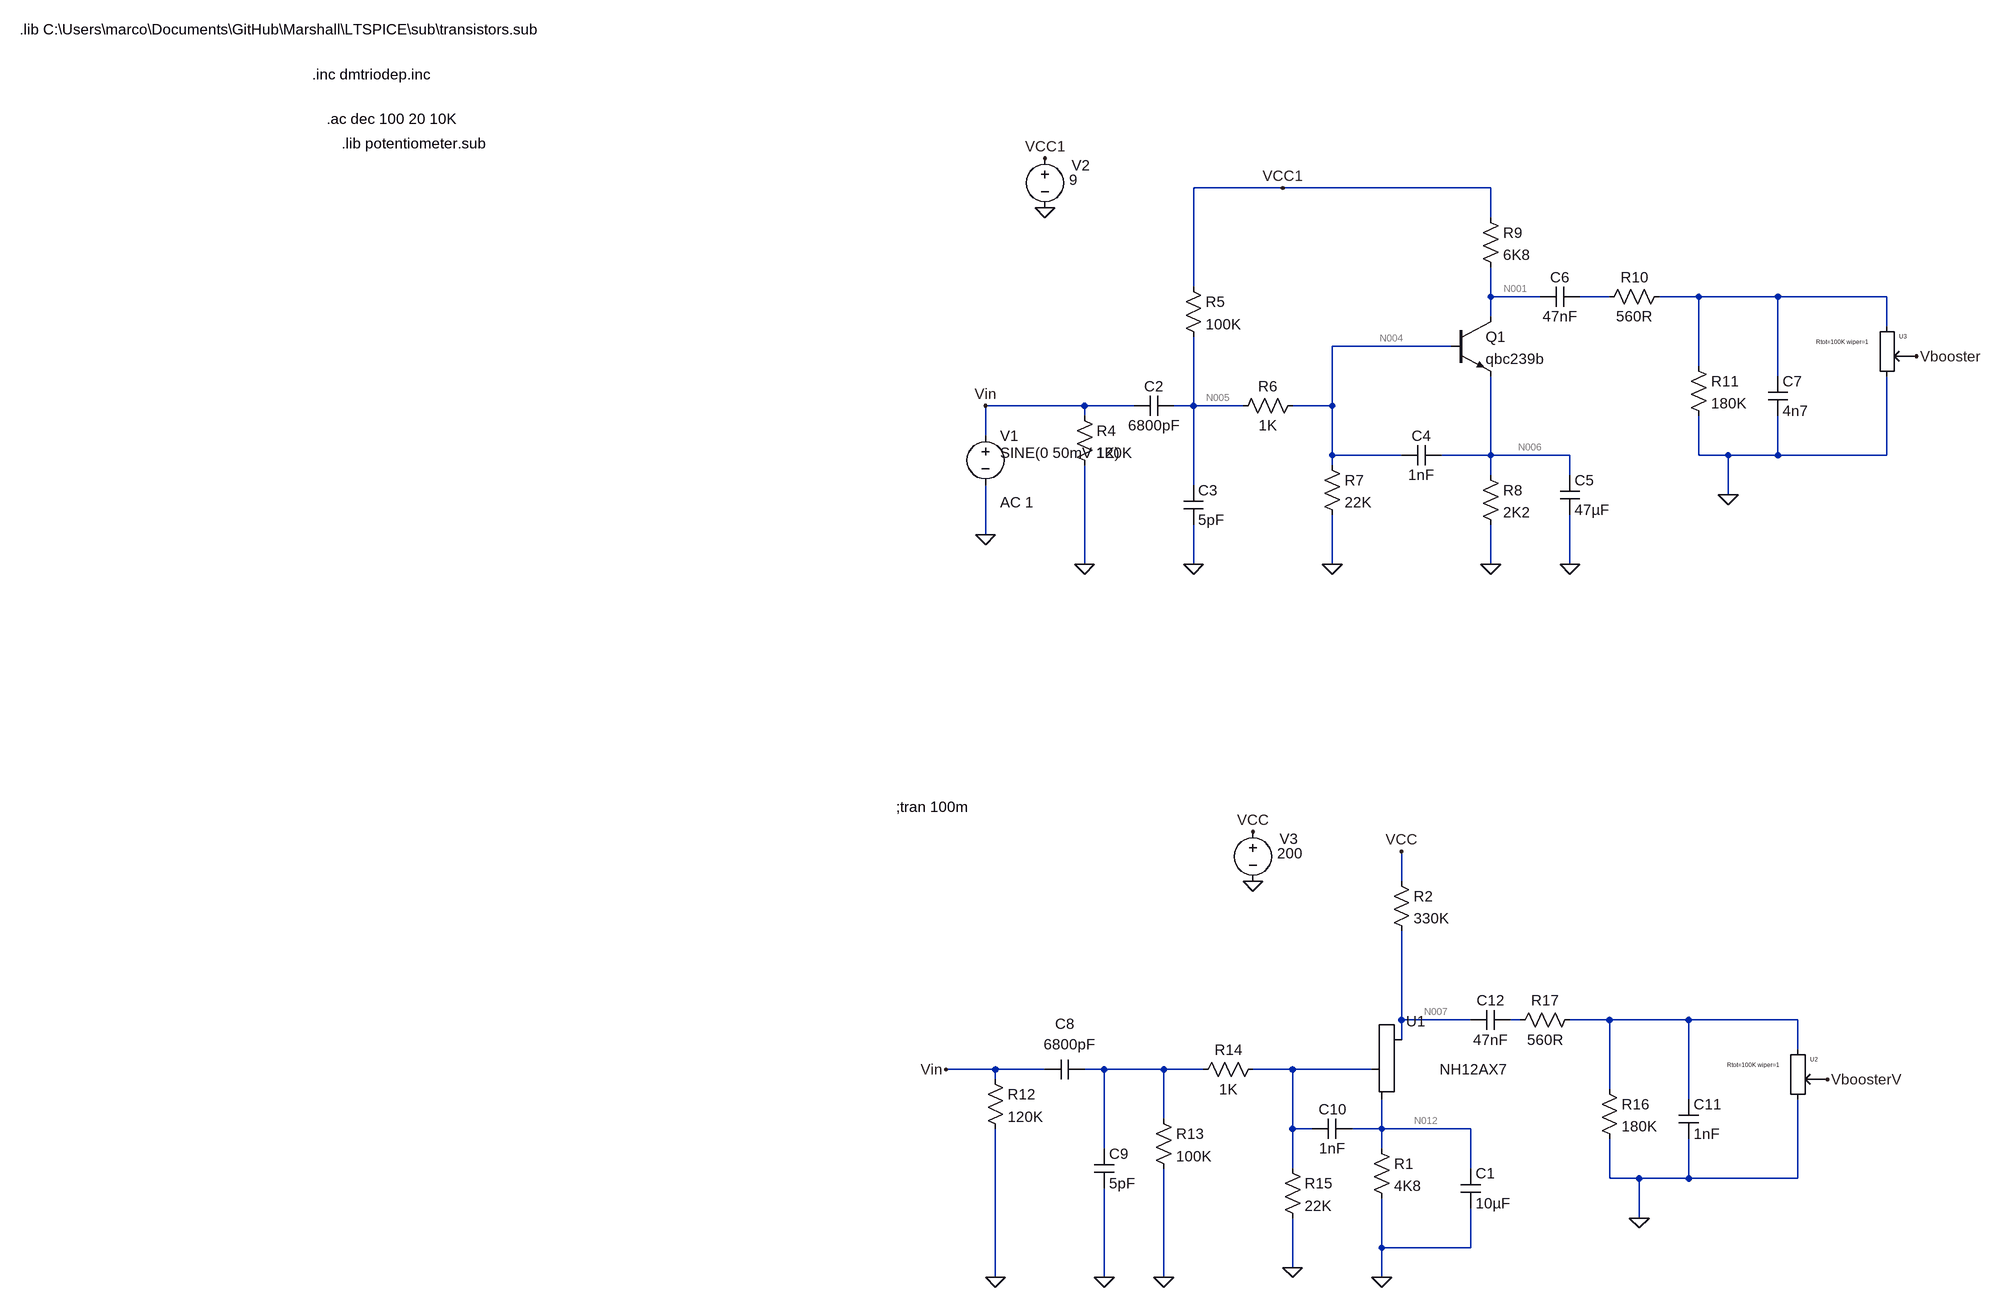
[diagram p0: schematic TBooster.asc]
TBooster.asc, the LTspice schematic file:
Version 4
SHEET 1 2152 2580
WIRE 1008 -112 864 -112
WIRE 1344 -112 1008 -112
WIRE 1344 -64 1344 -112
WIRE 864 48 864 -112
WIRE 1344 64 1344 16
WIRE 1424 64 1344 64
WIRE 1536 64 1488 64
WIRE 1680 64 1616 64
WIRE 1808 64 1680 64
WIRE 1984 64 1808 64
WIRE 1344 96 1344 64
WIRE 1984 112 1984 64
WIRE 1280 144 1088 144
WIRE 1680 176 1680 64
WIRE 1808 192 1808 64
WIRE 688 240 528 240
WIRE 768 240 688 240
WIRE 864 240 864 128
WIRE 864 240 832 240
WIRE 944 240 864 240
WIRE 1088 240 1088 144
WIRE 1088 240 1024 240
WIRE 688 256 688 240
WIRE 528 288 528 240
WIRE 1088 320 1088 240
WIRE 1200 320 1088 320
WIRE 1344 320 1344 192
WIRE 1344 320 1264 320
WIRE 1472 320 1344 320
WIRE 1680 320 1680 256
WIRE 1728 320 1680 320
WIRE 1808 320 1808 256
WIRE 1808 320 1728 320
WIRE 1984 320 1984 192
WIRE 1984 320 1808 320
WIRE 1088 336 1088 320
WIRE 1344 352 1344 320
WIRE 1472 352 1472 320
WIRE 864 368 864 240
WIRE 1728 384 1728 320
WIRE 528 448 528 368
WIRE 688 496 688 336
WIRE 864 496 864 432
WIRE 1088 496 1088 416
WIRE 1344 496 1344 432
WIRE 1472 496 1472 416
WIRE 1200 1008 1200 960
WIRE 1200 1232 1200 1088
WIRE 1312 1232 1200 1232
WIRE 1392 1232 1376 1232
WIRE 1536 1232 1472 1232
WIRE 1664 1232 1536 1232
WIRE 1840 1232 1664 1232
WIRE 1200 1264 1200 1232
WIRE 1840 1280 1840 1232
WIRE 544 1312 464 1312
WIRE 624 1312 544 1312
WIRE 720 1312 688 1312
WIRE 816 1312 720 1312
WIRE 880 1312 816 1312
WIRE 1024 1312 960 1312
WIRE 1152 1312 1024 1312
WIRE 544 1328 544 1312
WIRE 1536 1344 1536 1232
WIRE 1664 1360 1664 1232
WIRE 816 1392 816 1312
WIRE 1024 1408 1024 1312
WIRE 1056 1408 1024 1408
WIRE 1168 1408 1168 1360
WIRE 1168 1408 1120 1408
WIRE 1312 1408 1168 1408
WIRE 720 1440 720 1312
WIRE 1168 1440 1168 1408
WIRE 1024 1472 1024 1408
WIRE 1312 1472 1312 1408
WIRE 1536 1488 1536 1424
WIRE 1584 1488 1536 1488
WIRE 1664 1488 1664 1424
WIRE 1664 1488 1584 1488
WIRE 1840 1488 1840 1360
WIRE 1840 1488 1664 1488
WIRE 1584 1552 1584 1488
WIRE 1168 1600 1168 1520
WIRE 1312 1600 1312 1536
WIRE 1312 1600 1168 1600
WIRE 1024 1632 1024 1552
WIRE 544 1648 544 1408
WIRE 720 1648 720 1504
WIRE 816 1648 816 1472
WIRE 1168 1648 1168 1600
FLAG 1168 1648 0
FLAG 1200 960 VCC
FLAG 528 448 0
FLAG 624 -160 VCC1
FLAG 624 -80 0
FLAG 864 496 0
FLAG 688 496 0
FLAG 1088 496 0
FLAG 1344 496 0
FLAG 1472 496 0
FLAG 1728 384 0
FLAG 2032 160 Vbooster
FLAG 1008 -112 VCC1
FLAG 528 240 Vin
FLAG 960 928 VCC
FLAG 960 1008 0
FLAG 720 1648 0
FLAG 544 1648 0
FLAG 464 1312 Vin
FLAG 1024 1632 0
FLAG 816 1648 0
FLAG 1584 1552 0
FLAG 1888 1328 VboosterV
DATAFLAG 1200 1152 ""
DATAFLAG 1168 1408 ""
DATAFLAG 1344 320 ""
DATAFLAG 1088 240 ""
DATAFLAG 1344 64 ""
SYMBOL Misc\\triode 1200 1312 R0
WINDOW 3 62 0 Left 2
SYMATTR InstName U1
SYMATTR Value NH12AX7
SYMBOL res 1184 992 R0
SYMATTR InstName R2
SYMATTR Value 330K
SYMBOL voltage 528 272 R0
WINDOW 123 24 124 Left 2
WINDOW 39 0 0 Left 0
WINDOW 3 24 44 Left 2
SYMATTR Value2 AC 1
SYMATTR InstName V1
SYMATTR Value SINE(0 50mV 1K)
SYMBOL voltage 624 -176 R0
WINDOW 0 43 27 Left 2
WINDOW 3 39 51 Left 2
WINDOW 123 24 124 Left 2
WINDOW 39 0 0 Left 0
SYMATTR InstName V2
SYMATTR Value 9
SYMBOL npn 1280 96 R0
SYMATTR InstName Q1
SYMATTR Value qbc239b
SYMBOL res 672 240 R0
SYMATTR InstName R4
SYMATTR Value 120K
SYMBOL cap 832 224 R90
WINDOW 0 0 32 VBottom 2
WINDOW 3 32 32 VTop 2
SYMATTR InstName C2
SYMATTR Value 6800pF
SYMBOL res 848 32 R0
SYMATTR InstName R5
SYMATTR Value 100K
SYMBOL cap 848 368 R0
SYMATTR InstName C3
SYMATTR Value 5pF
SYMBOL res 1040 224 R90
WINDOW 0 0 56 VBottom 2
WINDOW 3 32 56 VTop 2
SYMATTR InstName R6
SYMATTR Value 1K
SYMBOL res 1072 320 R0
SYMATTR InstName R7
SYMATTR Value 22K
SYMBOL cap 1264 304 R90
WINDOW 0 0 32 VBottom 2
WINDOW 3 32 32 VTop 2
SYMATTR InstName C4
SYMATTR Value 1nF
SYMBOL res 1328 336 R0
SYMATTR InstName R8
SYMATTR Value 2K2
SYMBOL cap 1456 352 R0
SYMATTR InstName C5
SYMATTR Value 47µF
SYMBOL res 1328 -80 R0
SYMATTR InstName R9
SYMATTR Value 6K8
SYMBOL cap 1488 48 R90
WINDOW 0 0 32 VBottom 2
WINDOW 3 32 32 VTop 2
SYMATTR InstName C6
SYMATTR Value 47nF
SYMBOL res 1632 48 R90
WINDOW 0 0 56 VBottom 2
WINDOW 3 32 56 VTop 2
SYMATTR InstName R10
SYMATTR Value 560R
SYMBOL res 1664 160 R0
SYMATTR InstName R11
SYMATTR Value 180K
SYMBOL cap 1792 192 R0
SYMATTR InstName C7
SYMATTR Value 4n7
SYMBOL potentiometerEU 1968 96 R0
WINDOW 3 -98 41 Left 0
SYMATTR Value Rtot=100K wiper=1
SYMATTR InstName U3
SYMBOL voltage 960 912 R0
WINDOW 0 43 27 Left 2
WINDOW 3 39 51 Left 2
WINDOW 123 24 124 Left 2
WINDOW 39 0 0 Left 0
SYMATTR InstName V3
SYMATTR Value 200
SYMBOL res 528 1312 R0
SYMATTR InstName R12
SYMATTR Value 120K
SYMBOL cap 688 1296 R90
WINDOW 0 -42 32 VBottom 2
WINDOW 3 -40 25 VTop 2
SYMATTR InstName C8
SYMATTR Value 6800pF
SYMBOL res 800 1376 R0
SYMATTR InstName R13
SYMATTR Value 100K
SYMBOL cap 704 1440 R0
SYMATTR InstName C9
SYMATTR Value 5pF
SYMBOL res 976 1296 R90
WINDOW 0 0 56 VBottom 2
WINDOW 3 32 56 VTop 2
SYMATTR InstName R14
SYMATTR Value 1K
SYMBOL res 1008 1456 R0
SYMATTR InstName R15
SYMATTR Value 22K
SYMBOL res 1152 1424 R0
SYMATTR InstName R1
SYMATTR Value 4K8
SYMBOL cap 1296 1472 R0
SYMATTR InstName C1
SYMATTR Value 10µF
SYMBOL cap 1120 1392 R90
WINDOW 0 0 32 VBottom 2
WINDOW 3 32 32 VTop 2
SYMATTR InstName C10
SYMATTR Value 1nF
SYMBOL res 1520 1328 R0
SYMATTR InstName R16
SYMATTR Value 180K
SYMBOL cap 1648 1360 R0
SYMATTR InstName C11
SYMATTR Value 1nF
SYMBOL potentiometerEU 1824 1264 R0
WINDOW 3 -98 41 Left 0
SYMATTR Value Rtot=100K wiper=1
SYMATTR InstName U2
SYMBOL cap 1376 1216 R90
WINDOW 0 0 32 VBottom 2
WINDOW 3 32 32 VTop 2
SYMATTR InstName C12
SYMATTR Value 47nF
SYMBOL res 1488 1216 R90
WINDOW 0 0 56 VBottom 2
WINDOW 3 32 56 VTop 2
SYMATTR InstName R17
SYMATTR Value 560R
TEXT -560 -296 Left 2 !.inc dmtriodep.inc
TEXT -536 -224 Left 2 !.ac dec 100 20 10K
TEXT -512 -184 Left 2 !.lib potentiometer.sub
TEXT -1032 -368 Left 2 !.lib C:\\Users\\marco\\Documents\\GitHub\\Marshall\\LTSPICE\\sub\\transistors.sub
TEXT 384 888 Left 2 !;tran 100m

The netlist it stands for:
* TBooster.asc
XU1 N007 N011 N012 NH12AX7
R2 VCC N007 330K
V1 Vin 0 SINE(0 50mV 1K) AC 1
V2 VCC1 0 9
Q1 N001 N004 N006 0 qbc239b
R4 Vin 0 120K
C2 N005 Vin 6800pF
R5 VCC1 N005 100K
C3 N005 0 5pF
R6 N004 N005 1K
R7 N004 0 22K
C4 N006 N004 1nF
R8 N006 0 2K2
C5 N006 0 47µF
R9 VCC1 N001 6K8
C6 N002 N001 47nF
R10 N003 N002 560R
R11 N003 0 180K
C7 N003 0 4n7
XU3 N003 0 Vbooster potentiometer Rtot=100K wiper=1  ; pins A B C
V3 VCC 0 200
R12 Vin 0 120K
C8 N010 Vin 6800pF
R13 N010 0 100K
C9 N010 0 5pF
R14 N011 N010 1K
R15 N011 0 22K
R1 N012 0 4K8
C1 N012 0 10µF
C10 N012 N011 1nF
R16 N009 0 180K
C11 N009 0 1nF
XU2 N009 0 VboosterV potentiometer Rtot=100K wiper=1  ; pins A B C
C12 N008 N007 47nF
R17 N009 N008 560R
.model NPN NPN
.model PNP PNP
.lib standard.bjt
.inc dmtriodep.inc
.ac dec 100 20 10K
.lib potentiometer.sub
.lib C:\Users\marco\Documents\GitHub\Marshall\LTSPICE\sub\transistors.sub
;tran 100m
.backanno
.end

* Results of the author's LTspice run, read from the files saved beside the schematic
* Operating Point, zero values left out:
*   V(n007) = 110.3 V
*   V(n012) = 1.304 V
*   V(vcc) = 200 V
*   V(vcc1) = 9 V
*   V(n001) = 6.029 V
*   V(n004) = 1.584 V
*   V(n006) = 964.5 mV
*   V(n005) = 1.658 V
*   Ic(Q1) = 437 µA
*   Ib(Q1) = 1.421 µA
*   Ie(Q1) = -438.4 µA
*   I(R1) = 271.7 µA
*   I(R9) = 437 µA
*   I(R8) = 438.4 µA
*   I(R7) = 72 µA
*   I(R6) = -73.42 µA
*   I(R5) = 73.42 µA
*   I(R2) = 271.8 µA
*   I(V3) = -271.8 µA
*   I(V2) = -510.4 µA
*   Ix(u1:A) = 271.8 µA
*   Ix(u1:K) = -271.7 µA
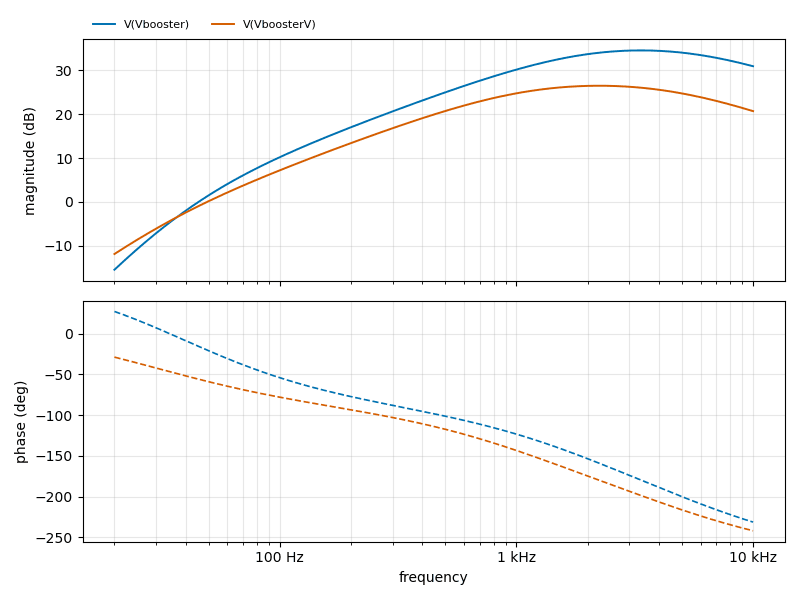
[diagram p1: AC Analysis of TBooster.asc, plotted from the saved traces]
* AC Analysis, 1 run:
*   V(Vbooster): -15.47 dB at 20 Hz, 30.95 dB at 10 kHz, peak 34.56 dB at 3.319 kHz, 3 dB below the peak at 1.246 kHz and 9.04 kHz
*   V(VboosterV): -11.89 dB at 20 Hz, 20.71 dB at 10 kHz, peak 26.50 dB at 2.244 kHz, 3 dB below the peak at 771 Hz and 6.459 kHz